# EAGLE schematic main-board (EAGLE 9.6.2)
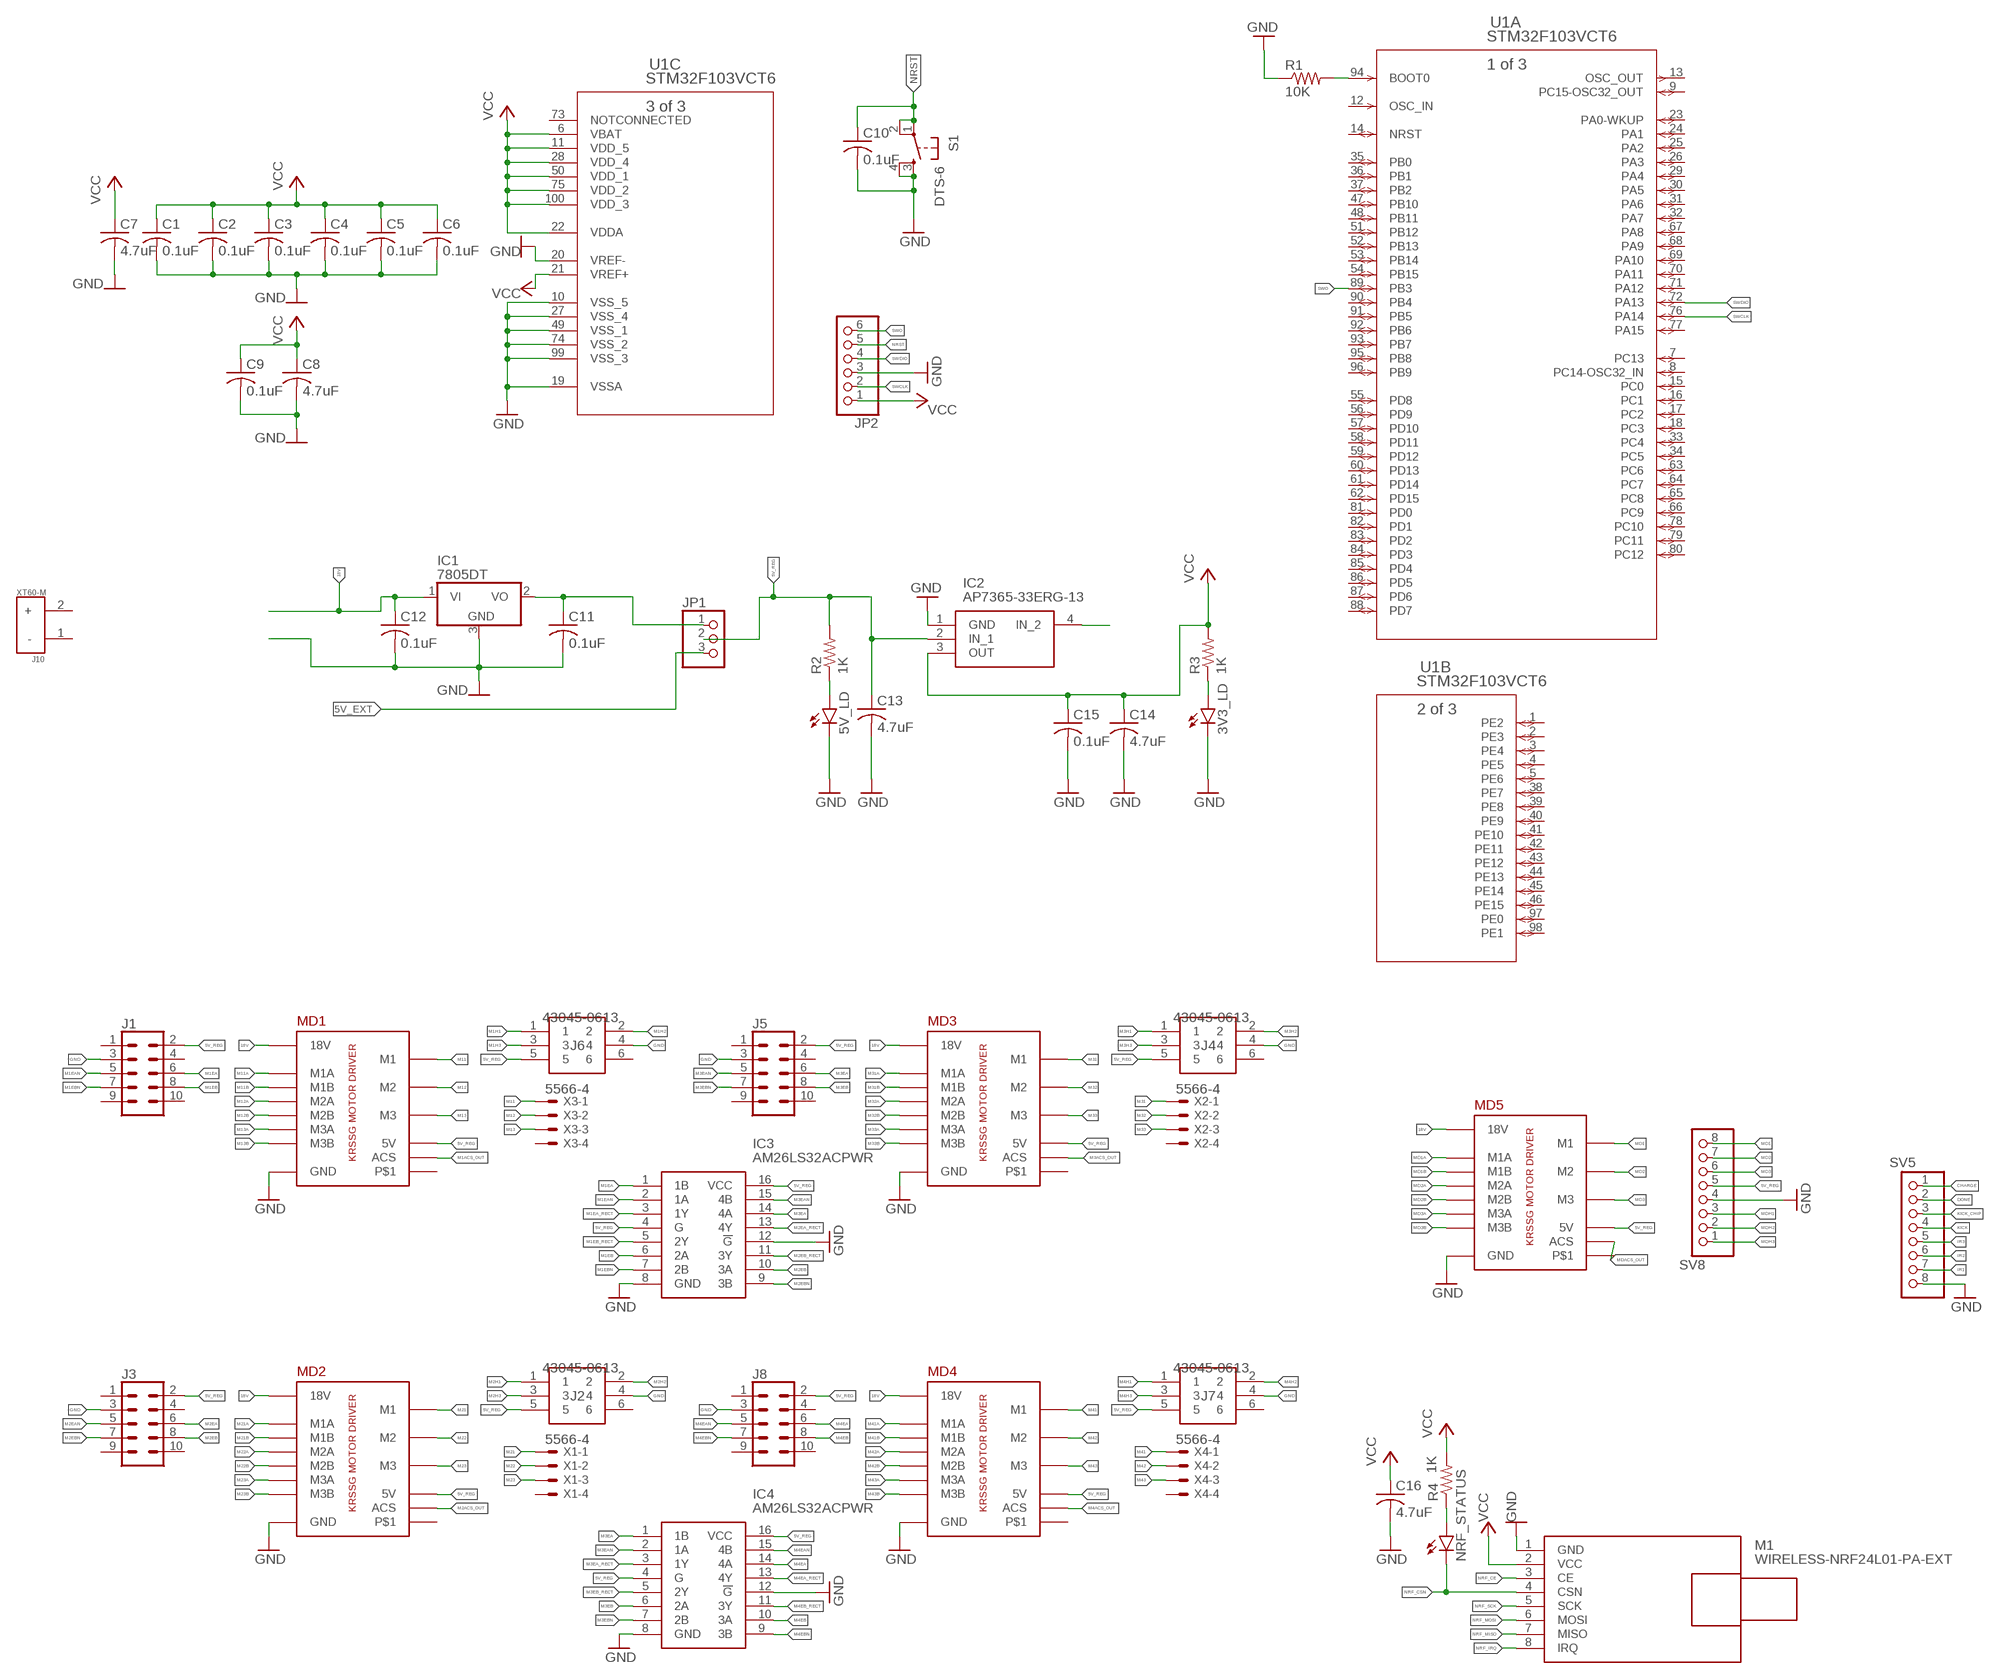
[diagram p0: schematic, sheet 1]

## Parts
3V3_LD  LEDCHIPLED_1206  [CHIPLED_1206]
5V_LD  LEDCHIPLED_1206  [CHIPLED_1206]
C1  0.1uF  C-USC1206  [C1206]
C2  0.1uF  C-USC1206  [C1206]
C3  0.1uF  C-USC1206  [C1206]
C4  0.1uF  C-USC1206  [C1206]
C5  0.1uF  C-USC1206  [C1206]
C6  0.1uF  C-USC1206  [C1206]
C7  4.7uF  C-USC1206  [C1206]
C8  4.7uF  C-USC1206  [C1206]
C9  0.1uF  C-USC1206  [C1206]
C10  0.1uF  C-USC1206  [C1206]
C11  0.1uF  C-USC1206  [C1206]
C12  0.1uF  C-USC1206  [C1206]
C13  4.7uF  C-USC1206  [C1206]
C14  4.7uF  C-USC1206  [C1206]
C15  0.1uF  C-USC1206  [C1206]
C16  4.7uF  C-USC1206  [C1206]
IC1  7805DT  [TO252]
IC2  AP7365-33ERG-13  [SOT230P700X180-4N]
IC3  AM26LS32ACPWR  [SOP65P640X120-16N]
IC4  AM26LS32ACPWR  [SOP65P640X120-16N]
J1  CONN_05X2SHD_LOCK  [2X5-SHROUDED_LOCK]
J2  43045-0613  [43045-0613]
J3  CONN_05X2SHD_LOCK  [2X5-SHROUDED_LOCK]
J4  43045-0613  [43045-0613]
J5  CONN_05X2SHD_LOCK  [2X5-SHROUDED_LOCK]
J6  43045-0613  [43045-0613]
J7  43045-0613  [43045-0613]
J8  CONN_05X2SHD_LOCK  [2X5-SHROUDED_LOCK]
J10  XT60-M  [AMASS_XT60-M]
JP1  PINHD-1X3  [1X03]
JP2  PINHD-1X6  [1X06]
M1  WIRELESS-NRF24L01-PA-EXT  [WIRELESS-NRD24L01-PA-EXT]
MD1  KRSSG_MOTOR_DRIVER  [KRSSG_MOTOR_DRIVER]
MD2  KRSSG_MOTOR_DRIVER  [KRSSG_MOTOR_DRIVER]
MD3  KRSSG_MOTOR_DRIVER  [KRSSG_MOTOR_DRIVER]
MD4  KRSSG_MOTOR_DRIVER  [KRSSG_MOTOR_DRIVER]
MD5  KRSSG_MOTOR_DRIVER  [KRSSG_MOTOR_DRIVER]
NRF_STATUS  LEDCHIPLED_1206  [CHIPLED_1206]
R1  10K  R-US_M1206  [M1206]
R2  1K  R-US_M1206  [M1206]
R3  1K  R-US_M1206  [M1206]
R4  1K  R-US_M1206  [M1206]
S1  DTS-6  [DTS-6]
SV5  PINHD-1X8  [1X08]
SV8  PINHD-1X8  [1X08]
U1  STM32F103VCT6  [LQFP100-14X14MM]
X1  5566-4  [5566-4]
X2  5566-4  [5566-4]
X3  5566-4  [5566-4]
X4  5566-4  [5566-4]

## Nets
5V_EXT: JP1.3
5V_REG: C13.1 IC2.2(IN_1) IC2.4(IN_2) IC3.4(G) IC3.16(VCC) IC4.4(G) IC4.16(VCC) J1.2 J2.5 J3.2 J4.5 J5.2 J6.5 J7.5 J8.2 JP1.2 MD1.5V MD2.5V MD3.5V MD4.5V MD5.5V R2.2 SV8.5
18V: C12.1 IC1.1(VI) MD1.18V MD1.18V_2(18V) MD2.18V MD2.18V_2(18V) MD3.18V MD3.18V_2(18V) MD4.18V MD4.18V_2(18V) MD5.18V MD5.18V_2(18V)
CHARGE: SV5.1
DONE: SV5.2
GND: 3V3_LD.C 5V_LD.C C1.2 C2.2 C3.2 C4.2 C5.2 C6.2 C7.2 C8.2 C9.2 C10.2 C11.2 C12.2 C13.2 C14.2 C15.2 C16.2 IC1.3(GND) IC2.1(GND) IC3.8(GND) IC3.12(!G) IC4.8(GND) IC4.12(!G) J1.3 J2.4 J3.3 J4.4 J5.3 J6.4 J7.4 J8.3 JP2.3 M1.1(GND) MD1.GND MD1.GND_2(GND) MD2.GND MD2.GND_2(GND) MD3.GND MD3.GND_2(GND) MD4.GND MD4.GND_2(GND) MD5.GND MD5.GND_2(GND) R1.1 S1.3 S1.4 SV5.8 SV8.4 U1.10(C:VSS_5) U1.19(C:VSSA) U1.20(C:VREF-) U1.27(C:VSS_4) U1.49(C:VSS_1) U1.74(C:VSS_2) U1.99(C:VSS_3)
IR1: SV5.7
IR2: SV5.6
IR3: SV5.5
KICK: SV5.4
KICK_CHIP: SV5.3
M1ACS_OUT: MD1.MACS_OUT(ACS)
M1EA: IC3.1(1B) J1.6
M1EA_RECT: IC3.3(1Y)
M1EAN: IC3.2(1A) J1.5
M1EB: IC3.6(2A) J1.8
M1EB_RECT: IC3.5(2Y)
M1EBN: IC3.7(2B) J1.7
M1H1: J6.1
M1H2: J6.2
M1H3: J6.3
M2ACS_OUT: MD2.MACS_OUT(ACS)
M2EA: J3.6
M2EA_RECT: IC3.13(4Y)
M2EAN: J3.5
M2EB: IC3.10(3A) J3.8
M2EB_RECT: IC3.11(3Y)
M2EBN: IC3.9(3B) J3.7
M2H1: J2.1
M2H2: J2.2
M2H3: J2.3
M3ACS_OUT: MD3.MACS_OUT(ACS)
M3EA: IC3.14(4A) IC4.1(1B) J5.6
M3EA_RECT: IC4.3(1Y)
M3EAN: IC3.15(4B) IC4.2(1A) J5.5
M3EB: IC4.6(2A) J5.8
M3EB_RECT: IC4.5(2Y)
M3EBN: IC4.7(2B) J5.7
M3H1: J4.1
M3H2: J4.2
M3H3: J4.3
M4ACS_OUT: MD4.MACS_OUT(ACS)
M4EA: IC4.14(4A) J8.6
M4EA_RECT: IC4.13(4Y)
M4EAN: IC4.15(4B) J8.5
M4EB: IC4.10(3A) J8.8
M4EB_RECT: IC4.11(3Y)
M4EBN: IC4.9(3B) J8.7
M4H1: J7.1
M4H2: J7.2
M4H3: J7.3
M11: MD1.M1 MD1.M1_2(M1) X3.1
M11A: MD1.M1A
M11B: MD1.M1B
M12: MD1.M2 MD1.M2_2(M2) X3.2
M12A: MD1.M2A
M12B: MD1.M2B
M13: MD1.M3 MD1.M3_2(M3) X3.3
M13A: MD1.M3A
M13B: MD1.M3B
M21: MD2.M1 MD2.M1_2(M1) X1.1
M21A: MD2.M1A
M21B: MD2.M1B
M22: MD2.M2 MD2.M2_2(M2) X1.2
M22A: MD2.M2A
M22B: MD2.M2B
M23: MD2.M3 MD2.M3_2(M3) X1.3
M23A: MD2.M3A
M23B: MD2.M3B
M31: MD3.M1 MD3.M1_2(M1) X2.1
M31A: MD3.M1A
M31B: MD3.M1B
M32: MD3.M2 MD3.M2_2(M2) X2.2
M32A: MD3.M2A
M32B: MD3.M2B
M33: MD3.M3 MD3.M3_2(M3) X2.3
M33A: MD3.M3A
M33B: MD3.M3B
M41: MD4.M1 MD4.M1_2(M1) X4.1
M41A: MD4.M1A
M41B: MD4.M1B
M42: MD4.M2 MD4.M2_2(M2) X4.2
M42A: MD4.M2A
M42B: MD4.M2B
M43: MD4.M3 MD4.M3_2(M3) X4.3
M43A: MD4.M3A
M43B: MD4.M3B
MD1: MD5.M1 MD5.M1_2(M1) SV8.8
MD1A: MD5.M1A
MD1B: MD5.M1B
MD2: MD5.M2 MD5.M2_2(M2) SV8.7
MD2A: MD5.M2A
MD2B: MD5.M2B
MD3: MD5.M3 MD5.M3_2(M3) SV8.6
MD3A: MD5.M3A
MD3B: MD5.M3B
MDACS_OUT: MD5.MACS_OUT(ACS)
MDH1: SV8.3
MDH2: SV8.2
MDH3: SV8.1
N$1: R1.2 U1.94(A:BOOT0)
N$2: 3V3_LD.A R3.1
N$3: C11.1 IC1.2(VO) JP1.1
N$4: 5V_LD.A R2.1
N$7: NRF_STATUS.A R4.1
NRF_CE: M1.3(CE)
NRF_CSN: M1.4(CSN) NRF_STATUS.C
NRF_IRQ: M1.8(IRQ)
NRF_MISO: M1.7(MISO)
NRF_MOSI: M1.6(MOSI)
NRF_SCK: M1.5(SCK)
NRST: C10.1 JP2.5 S1.1 S1.2
SWCLK: JP2.2 U1.76(A:PA14)
SWDIO: JP2.4 U1.72(A:PA13)
SWO: JP2.6 U1.89(A:PB3)
VCC: C1.1 C2.1 C3.1 C4.1 C5.1 C6.1 C7.1 C8.1 C9.1 C14.1 C15.1 C16.1 IC2.3(OUT) JP2.1 M1.2(VCC) R3.2 R4.2 U1.6(C:VBAT) U1.11(C:VDD_5) U1.21(C:VREF+) U1.22(C:VDDA) U1.28(C:VDD_4) U1.50(C:VDD_1) U1.75(C:VDD_2) U1.100(C:VDD_3)
Unconnected: J1.1 J1.4 J1.9 J1.10 J2.6 J3.1 J3.4 J3.9 J3.10 J4.6 J5.1 J5.4 J5.9 J5.10 J6.6 J7.6 J8.1 J8.4 J8.9 J8.10 J10.1(-) J10.2(+) MD1.IN17 MD1.IN18 MD2.IN17 MD2.IN18 MD3.IN17 MD3.IN18 MD4.IN17 MD4.IN18 MD5.IN17 MD5.IN18 U1.1(B:PE2) U1.2(B:PE3) U1.3(B:PE4) U1.4(B:PE5) U1.5(B:PE6) U1.7(A:PC13) U1.8(A:PC14-OSC32_IN) U1.9(A:PC15-OSC32_OUT) U1.12(A:OSC_IN) U1.13(A:OSC_OUT) U1.14(A:NRST) U1.15(A:PC0) U1.16(A:PC1) U1.17(A:PC2) U1.18(A:PC3) U1.23(A:PA0-WKUP) U1.24(A:PA1) U1.25(A:PA2) U1.26(A:PA3) U1.29(A:PA4) U1.30(A:PA5) U1.31(A:PA6) U1.32(A:PA7) U1.33(A:PC4) U1.34(A:PC5) U1.35(A:PB0) U1.36(A:PB1) U1.37(A:PB2) U1.38(B:PE7) U1.39(B:PE8) U1.40(B:PE9) U1.41(B:PE10) U1.42(B:PE11) U1.43(B:PE12) U1.44(B:PE13) U1.45(B:PE14) U1.46(B:PE15) U1.47(A:PB10) U1.48(A:PB11) U1.51(A:PB12) U1.52(A:PB13) U1.53(A:PB14) U1.54(A:PB15) U1.55(A:PD8) U1.56(A:PD9) U1.57(A:PD10) U1.58(A:PD11) U1.59(A:PD12) U1.60(A:PD13) U1.61(A:PD14) U1.62(A:PD15) U1.63(A:PC6) U1.64(A:PC7) U1.65(A:PC8) U1.66(A:PC9) U1.67(A:PA8) U1.68(A:PA9) U1.69(A:PA10) U1.70(A:PA11) U1.71(A:PA12) U1.73(C:NOTCONNECTED) U1.77(A:PA15) U1.78(A:PC10) U1.79(A:PC11) U1.80(A:PC12) U1.81(A:PD0) U1.82(A:PD1) U1.83(A:PD2) U1.84(A:PD3) U1.85(A:PD4) U1.86(A:PD5) U1.87(A:PD6) U1.88(A:PD7) U1.90(A:PB4) U1.91(A:PB5) U1.92(A:PB6) U1.93(A:PB7) U1.95(A:PB8) U1.96(A:PB9) U1.97(B:PE0) U1.98(B:PE1) X1.4 X2.4 X3.4 X4.4

## Library data of the parts
3V3_LD 5V_LD NRF_STATUS = led:LED: LED OSRAM: - CHIPLED LG R971, LG N971, LY N971, LG Q971, LY Q971, LO R971, LY R971 LH N974, LH R974 LS Q976, LO Q976, LY Q976 LO Q996 - Hyper CHIPLED LW Q18S LB Q993, LB Q99A, LB R99A - SideLED LS A670, LO A670, LY A670, LG A670, LP A670 LB A673, LV A673, LT A673, LW A673 LH A674 LY A675 LS A676, LA A676, LO A676, LY A676, LW A676 LS A679, LY A679, LG A679 - Hyper Micro SIDELED® LS Y876, LA Y876, LO Y876, LY Y876 LT Y87S - SmartLED LW L88C, LW L88S LB L89C, LB L89S, LG L890 LS L89K, LO L89K, LY L89K LS L896, LA L896, LO L896, LY L896 - TOPLED LS T670, LO T670, LY T670, LG T670, LP T670 LSG T670, LSP T670, LSY T670, LOP T670, LYG T670 LG T671, LOG T671, LSG T671 LB T673, LV T673, LT T673, LW T673 LH T674 LS T676, LA T676, LO T676, LY T676, LB T676, LH T676, LSB T676, LW T676 LB T67C, LV T67C, LT T67C, LS T67K, LO T67K, LY T67K, LW E67C LS E67B, LA E67B, LO E67B, LY E67B, LB E67C, LV E67C, LT E67C LW T67C LS T679, LY T679, LG T679 LS T770, LO T770, LY T770, LG T770, LP T770 LB T773, LV T773, LT T773, LW T773 LH T774 LS E675, LA E675, LY E675, LS T675 LS T776, LA T776, LO T776, LY T776, LB T776 LHGB T686 LT T68C, LB T68C - Hyper Mini TOPLED® LB M676 - Mini TOPLED Santana® LG M470 LS M47K, LO M47K, LY M47K Source: http://www.osram.convergy.de LUXEON: - LUMILED® LXK2-PW12-R00, LXK2-PW12-S00, LXK2-PW14-U00, LXK2-PW14-V00 LXK2-PM12-R00, LXK2-PM12-S00, LXK2-PM14-U00 LXK2-PE12-Q00, LXK2-PE12-R00, LXK2-PE12-S00, LXK2-PE14-T00, LXK2-PE14-U00 LXK2-PB12-K00, LXK2-PB12-L00, LXK2-PB12-M00, LXK2-PB14-N00, LXK2-PB14-P00, LXK2-PB14-Q00 LXK2-PR12-L00, LXK2-PR12-M00, LXK2-PR14-Q00, LXK2-PR14-R00 LXK2-PD12-Q00, LXK2-PD12-R00, LXK2-PD12-S00 LXK2-PH12-R00, LXK2-PH12-S00 LXK2-PL12-P00, LXK2-PL12-Q00, LXK2-PL12-R00 Source: www.luxeon.com KINGBRIGHT: KA-3528ASYC Source: www.kingbright.com
C1-C16 = rcl:C-US: CAPACITOR, American symbol; SPICEPREFIX: C
IC1 = linear:78*: Positive VOLTAGE REGULATOR Source: http://cache.national.com/ds/LM/LM78L05.pdf http://www.fairchildsemi.com/ds/LM/LM7805.pdf
IC2 = SamacSys_Parts:AP7365-33ERG-13: LDO Voltage Regulators LDO 3.3V OUT 600mA 35uA 2 to 6 Vin Source: Datasheet <https://datasheet.datasheetarchive.com/originals/distributors/Datasheets-DGA25/1800212.pdf>; DESCRIPTION: LDO Voltage Regulators LDO 3.3V OUT 600mA 35uA 2 to 6 Vin; HEIGHT: 1.8mm; MANUFACTURER_NAME: Diodes Inc.; MANUFACTURER_PART_NUMBER: AP7365-33ERG-13
IC3 IC4 = SamacSys_Parts:AM26LS32ACPWR: Quadruple Differential Line Receivers Source: Datasheet <http://www.ti.com/lit/ds/symlink/am26ls32ac.pdf>; DESCRIPTION: Quadruple Differential Line Receivers; HEIGHT: 1.2mm; MANUFACTURER_NAME: Texas Instruments; MANUFACTURER_PART_NUMBER: AM26LS32ACPWR; MOUSER_PART_NUMBER: 595-AM26LS32ACPWR; MOUSER_PRICE-STOCK: https://www.mouser.co.uk/ProductDetail/Texas-Instruments/AM26LS32ACPWR?qs=Q0GlgB%252BOca9gSFUE%2Fs604w%3D%3D
J1 J3 J5 J8 = SparkFun-Connectors:CONN_05X2: Multi connection point. Often used as Generic Header-pin footprint for 0.1 inch spaced/style header connections For AVR SPI programming port, see special device with nice symbol: "AVR_SPI_PROG_5x2.dev" You can populate with any combo of single row headers, but if you'd like an exact match, check these: 2x5 AVR ICSP Male Header <https://www.sparkfun.com/products/778> (PRT-00778) 2x5 Pin Shrouded Header <https://www.sparkfun.com/products/8506> (PRT-08506) On any of the 0.1 inch spaced packages, you can populate with these: Break Away Headers - Straight <https://www.sparkfun.com/products/116> (PRT-00116) Break Away Male Headers - Right Angle <https://www.sparkfun.com/products/553> (PRT-00553) Female Headers <https://www.sparkfun.com/products/115> (PRT-00115) Break Away Headers - Machine Pin <https://www.sparkfun.com/products/117> (PRT-00117) Break Away Female Headers - Swiss Machine Pin <https://www.sparkfun.com/products/743> (PRT-00743) Special note: the shrouded connector mates well with our 5x2 ribbon cables: 2x5 Pin IDC Ribbon Cable <https://www.sparkfun.com/products/8535> (PRT-08535); PROD_ID: CONN-08671; SF_ID: PRT-08506
J2 J4 J6 J7 = 43045-0613:43045-0613: Header 3.00mm, WTB, dual row, vert,6w Molex MICRO-FIT 3.0 Series, Series Number 43045, 3mm Pitch 6 Way 2 Row Straight PCB Header, Solder Termination, 5A Source: Datasheet <http://uk.rs-online.com/webdocs/150e/0900766b8150e466.pdf>; ALLIED_NUMBER: 70090681; ALLIED_PRICE-STOCK: http://www.alliedelec.com/molex-incorporated-43045-0613/70090681/; DESCRIPTION: Header 3.00mm, WTB, dual row, vert,6w Molex MICRO-FIT 3.0 Series, Series Number 43045, 3mm Pitch 6 Way 2 Row Straight PCB Header, Solder Termination, 5A; HEIGHT: mm; MANUFACTURER_NAME: Molex; MANUFACTURER_PART_NUMBER: 43045-0613; MOUSER_PART_NUMBER: 538-43045-0613; MOUSER_PRICE-STOCK: https://www.mouser.com/Search/Refine.aspx?Keyword=538-43045-0613; RS_PART_NUMBER: 6700377P; RS_PRICE-STOCK: http://uk.rs-online.com/web/p/products/6700377P
J10 = XT60-M:XT60-M: DC supply; XT60; male; PIN:2; for cable; soldered; 60A; 500V Check availability <https://pricing.snapeda.com/parts/XT60-M/AMASS/view-part?ref=eda>; AVAILABILITY: In Stock; DESCRIPTION: Plug; DC supply; XT60; male; PIN: 2; for cable; soldered; 30A; 500V; MF: AMASS; MP: XT60-M; PACKAGE: Package; PRICE: None
JP1 = pinhead:PINHD-1X3: PIN HEADER
JP2 = pinhead:PINHD-1X6: PIN HEADER
M1 = diy_modules_2:WIRELESS-NRF24L01-PA-EXT: 2.4 GHz Wireless Module based on NRF24L01 chip with preamplifier and external antenna
MD1-MD5 = KRSSG_MOTOR_DRIVER:KRSSG_MOTOR_DRIVER
R1-R4 = rcl:R-US_: RESISTOR, American symbol; SPICEPREFIX: R
S1 = switch-tact:DTS-6
SV5 SV8 = pinhead:PINHD-1X8: PIN HEADER
U1 = STM32F103VCT6:STM32F103VCT6; COPYRIGHT: Copyright (C) 2022 Ultra Librarian. All rights reserved.; MANUFACTURER_PART_NUMBER: STM32F103VCT6; MFR_NAME: STMicroelectronics
X1-X4 = con-molex:5566-4: Mini FIT connector 4 pol Source: http://www.molex.com; MF: MOLEX; OC_FARNELL: unknown; OC_NEWARK: unknown